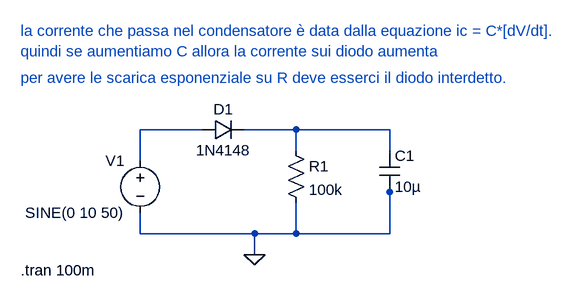
[diagram p0: schematic 04. circuito rettificatore filtro rc.asc]
04. circuito rettificatore filtro rc.asc, the LTspice schematic file:
Version 4
SHEET 1 880 680
WIRE 128 80 32 80
WIRE 272 80 192 80
WIRE 416 80 272 80
WIRE 272 112 272 80
WIRE 416 112 416 80
WIRE 32 128 32 80
WIRE 416 176 416 160
WIRE 32 240 32 208
WIRE 208 240 32 240
WIRE 272 240 272 192
WIRE 272 240 208 240
WIRE 416 240 416 176
WIRE 416 240 272 240
WIRE 208 272 208 240
FLAG 208 272 0
SYMBOL voltage 32 112 M0
WINDOW 123 0 0 Left 0
WINDOW 39 24 124 Left 2
SYMATTR InstName V1
SYMATTR Value SINE(0 10 50)
SYMBOL diode 128 96 R270
WINDOW 0 32 32 VTop 2
WINDOW 3 0 32 VBottom 2
SYMATTR InstName D1
SYMATTR Value 1N4148
SYMBOL res 256 96 R0
SYMATTR InstName R1
SYMATTR Value 100k
SYMBOL cap 400 112 R0
SYMATTR InstName C1
SYMATTR Value 10µ
TEXT -152 296 Left 2 !.tran 100m
TEXT -152 0 Left 2 ;per avere le scarica esponenziale su R deve esserci il diodo interdetto.
TEXT -152 -72 Left 2 ;la corrente che passa nel condensatore è data dalla equazione ic = C*[dV/dt].\nquindi se aumentiamo C allora la corrente sui diodo aumenta

The netlist it stands for:
* 04. circuito rettificatore filtro rc.asc
V1 N001 0 SINE(0 10 50)
D1 N001 N002 1N4148
R1 N002 0 100k
C1 N002 0 10µ
.model D D
.lib standard.dio
.tran 100m
* per avere le scarica esponenziale su R deve esserci il diodo interdetto.
* la corrente che passa nel condensatore è data dalla equazione ic = C*[dV/dt].
* quindi se aumentiamo C allora la corrente sui diodo aumenta
.backanno
.end